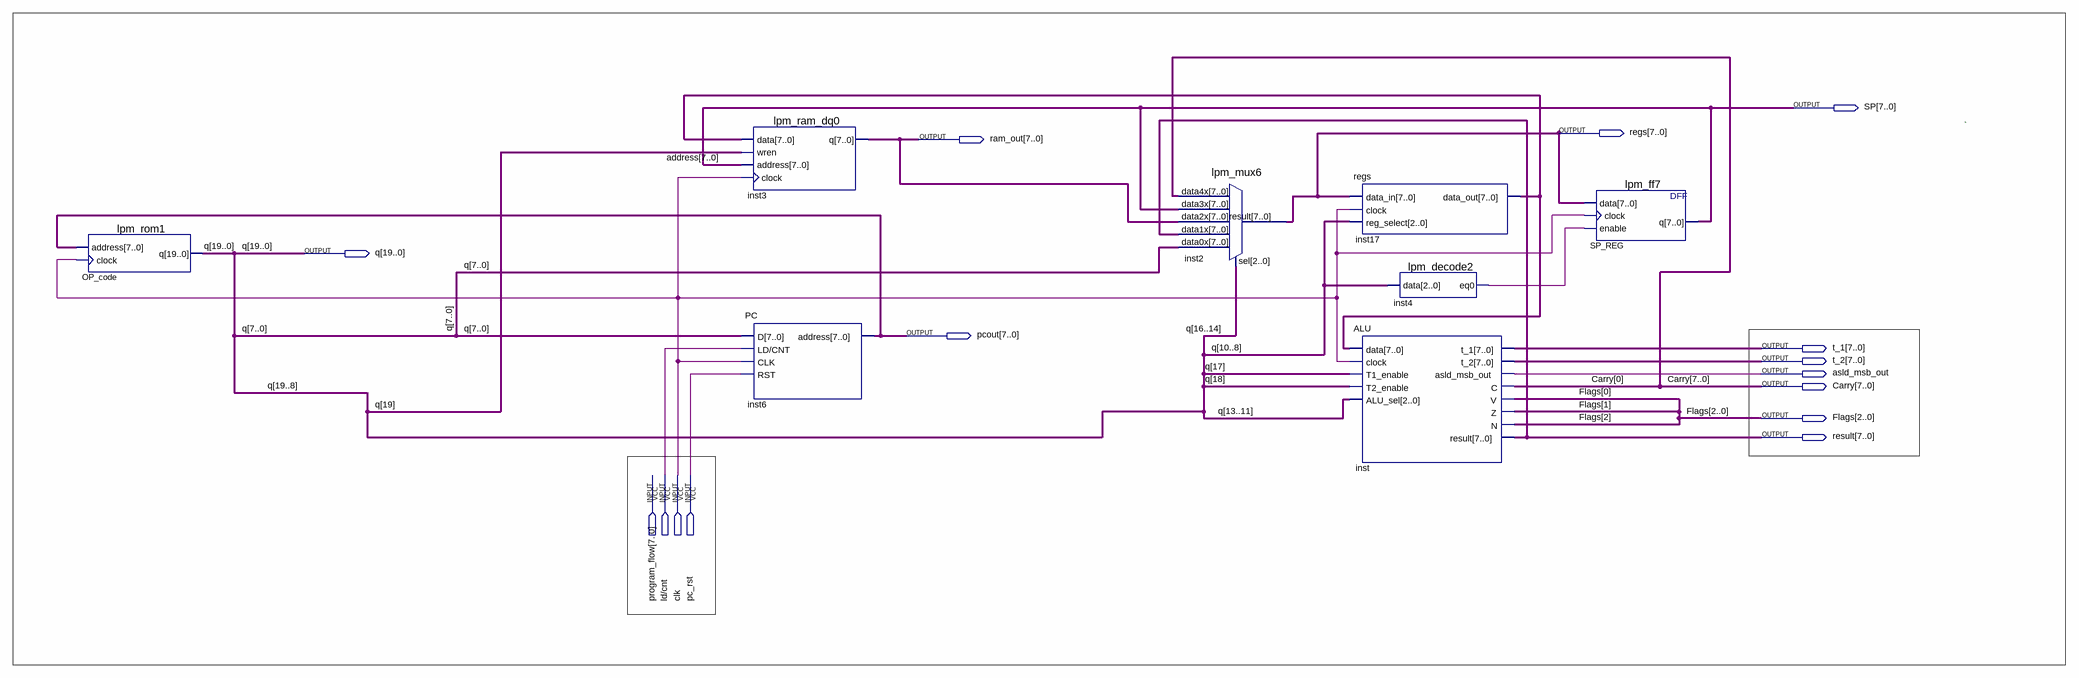
[diagram p0: schematic sheet]
// Quartus schematic HC11_moc.bdf as structural Verilog: 8 symbols, 15 pins
module HC11_moc (
  input  [7:0] program_flow,
  input  \ld/cnt ,
  input  clk,
  input  pc_rst,
  output [7:0] SP,
  output [7:0] regs,
  output [7:0] ram_out,
  output [19:0] q,
  output [7:0] pcout,
  output [7:0] t_1,
  output [7:0] t_2,
  output asld_msb_out,
  output [7:0] Carry,
  output [2:0] Flags,
  output [7:0] result
);

  wire inst4_eq0;
  wire [7:0] inst17_data_out;

  lpm_rom1 OP_code (.address(pcout), .clock(clk), .q(q));
  lpm_ram_dq0 inst3 (.data(inst17_data_out), .wren(q[19]), .address(SP), .clock(clk), .q(ram_out));
  PC inst6 (.D(q[7:0]), .\LD/CNT (\ld/cnt ), .CLK(clk), .RST(pc_rst), .address(pcout));
  lpm_mux6 inst2 (
    .data4x(Carry), .data3x(SP), .data2x(ram_out), .data1x(result), .data0x(q[7:0]), .sel(q[16:14]),
    .result(regs));
  regs inst17 (.data_in(regs), .clock(clk), .reg_select(q[10:8]), .data_out(inst17_data_out));
  ALU inst (
    .data(inst17_data_out), .clock(clk), .T1_enable(q[17]), .T2_enable(q[18]), .ALU_sel(q[13:11]), .t_1(t_1),
    .t_2(t_2), .asld_msb_out(asld_msb_out), .C(Carry[0]), .V(Flags[0]), .Z(Flags[1]), .N(Flags[2]),
    .result(result));
  lpm_decode2 inst4 (.data(q[10:8]), .eq0(inst4_eq0));
  lpm_ff7 SP_REG (.data(regs), .clock(clk), .enable(inst4_eq0), .q(SP));

  // Other names for the same wires on the sheet: address[7:0] = SP

  // Notes on the sheet:
  //   `
endmodule
